# EasyEDA schematic LcsNodes-Building-Block-Dual-L6205.json
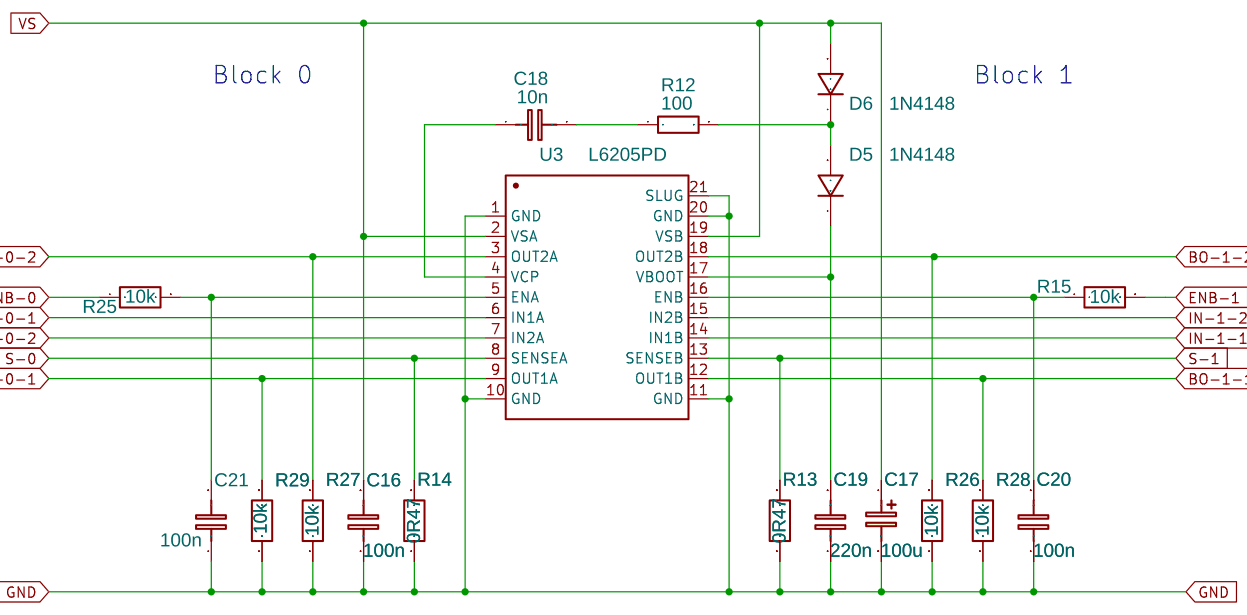
[diagram p0: schematic sheet]

## Parts
C16  100n  [C1206]
C17  100u  [CAP-D6.3×H7.7]
C18  10n  [C1206]
C19  220n  [C1206]
C20  100n  [C1206]
C21  100n  [C1206]
D5  1N4148  [SOD-80C_L3.3-W1.5-RD]
D6  1N4148  [SOD-80C_L3.3-W1.5-RD]
R12  100  [R1206]
R13  0R47  [R_AXIAL-0.7]
R14  0R47  [R_AXIAL-0.7]
R15  10k  [R1206]
R25  10k  [R1206]
R26  10k  [R1206]
R27  10k  [R1206]
R28  10k  [R1206]
R29  10k  [R1206]
U3  L6205PD  [POWERSO20_L15.9-W11.0-P1.27-LS14.2-BL-EP]

## Library data of the parts
C16 C18-C21 = C_0603_EU: Contributor: LCEDA_Lib
C17 = CE_SMD_D5.0×H5.5_EU: Contributor: LCEDA_Lib
D5 D6 = 1N4148: Supplier: LCSC; Manufacturer: SEMTECH; Supplier Part: C14516; Contributor: LCEDA_Lib
R12 = RESISTOR-AXIAL-0.1
R13 R14 = R_AXIAL-0.5_EU: Contributor: LCEDA_Lib
R15 R25-R29 = R_AXIAL-0.3_EU: Contributor: LCEDA_Lib
U3 = L6205PD: Supplier: LCSC; Manufacturer: ST(意法半导体); Manufacturer Part: L6205PD013TR; Supplier Part: C36543; JLCPCB Part Class: Extended Part

## Nets
GND: C16.1 C17.2 C19.1 C20.1 C21.1 R13.1 R14.1 R26.1 R27.1 R28.1 R29.1 U3.1(GND) U3.10(GND) U3.11(GND) U3.20(GND) U3.21(SLUG)
BO-0-1: R29.2 U3.9(OUT1A)
BO-0-2: R27.2 U3.3(OUT2A)
BO-1-1: R28.2 U3.12(OUT1B)
BO-1-2: R26.2 U3.18(OUT2B)
ENB-0: R25.1
ENB-1: R15.2
IN-0-1: U3.6(IN1A)
IN-0-2: U3.7(IN2A)
IN-1-1: U3.14(IN1B)
IN-1-2: U3.15(IN2B)
S-0: R14.2 U3.8(SENSEA)
S-1: R13.2 U3.13(SENSEB)
VS: C16.2 C17.1 D6.2(1) U3.2(VSA) U3.19(VSB)
Net-(C18-1): C18.1 U3.4(VCP)
Net-(C18-2): C18.2 R12.1
Net-(C19-2): C19.2 D5.1(2) U3.17(VBOOT)
Net-(C20-2): C20.2 R15.1 U3.16(ENB)
Net-(C21-2): C21.2 R25.2 U3.5(ENA)
Net-(D5-2): D5.2(1) D6.1(2) R12.2

## Notes on the sheet
- Block 0
- Block 1
- LcsNodes-Building-Block-Dual-L6205
